# EAGLE design pH-ver1 (EAGLE 9.0.1)

## Sheet 1 of 2
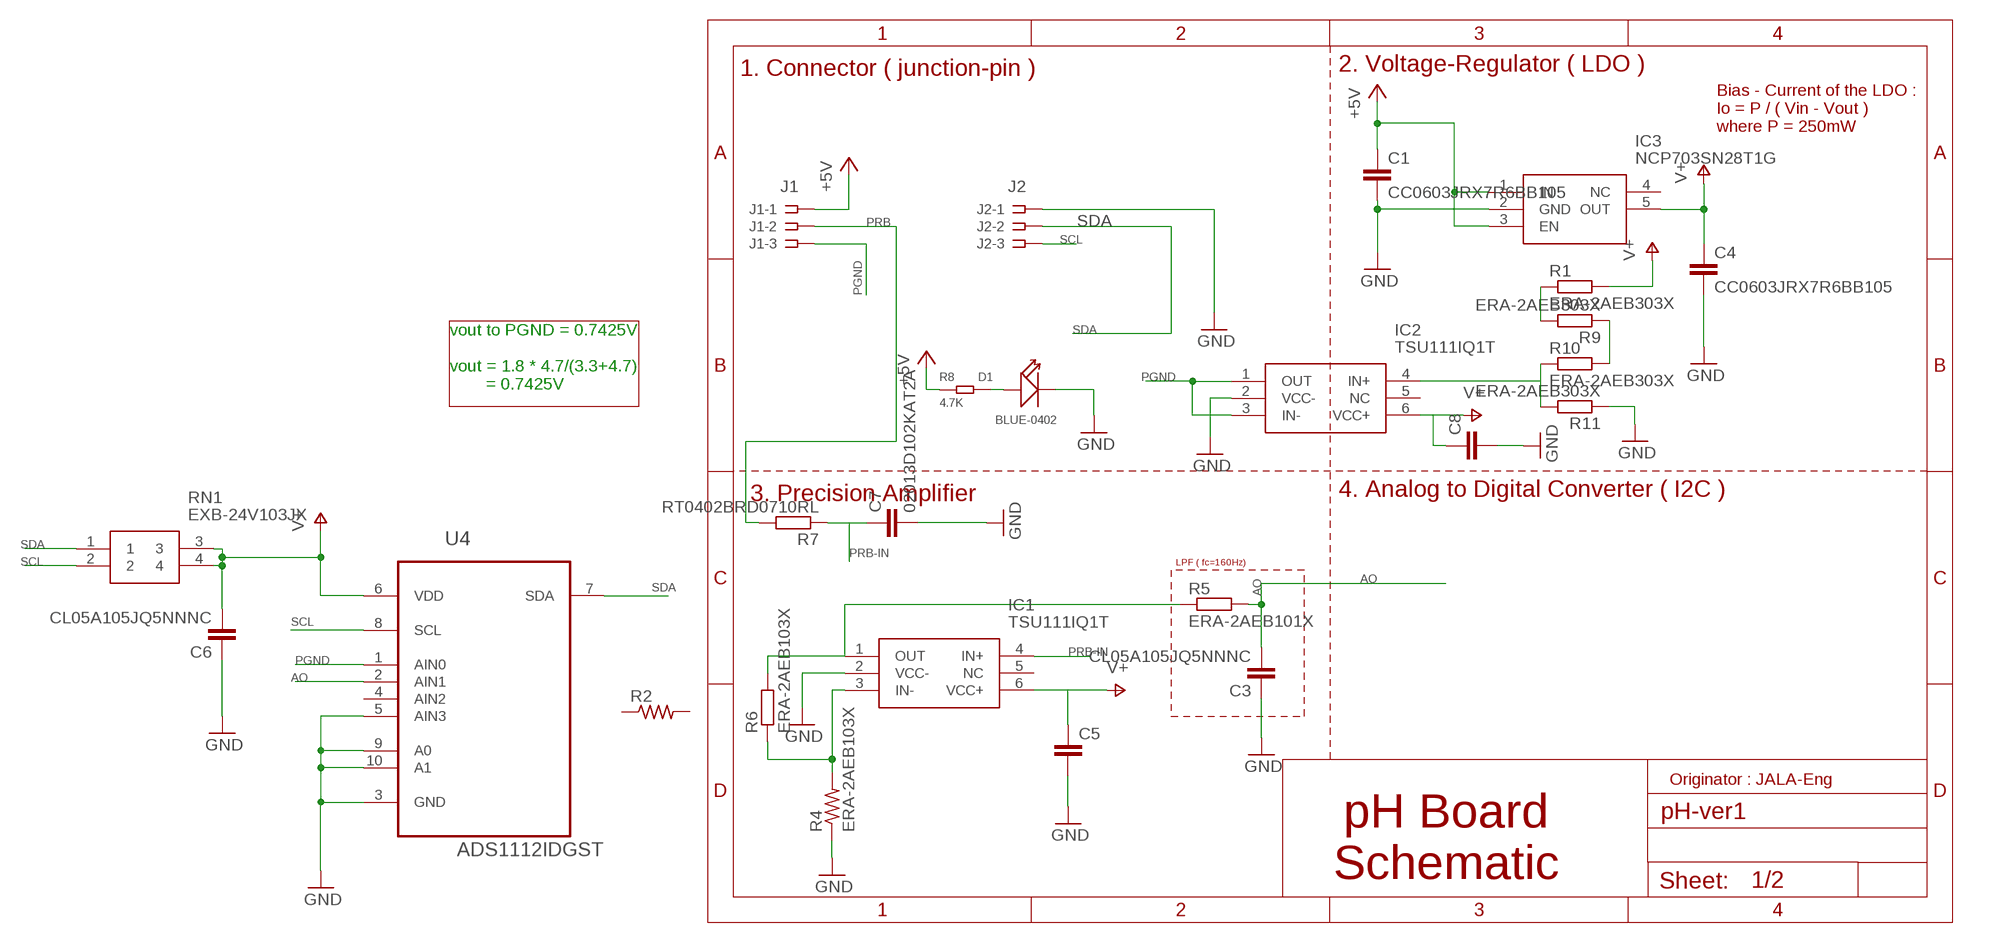
[diagram p0: schematic, sheet 1]

### Parts
C1  CC0603JRX7R6BB105  C-EUC0603  [C0603]
C3  CL05A105JQ5NNNC  C-EUC0402  [C0402]
C4  CC0603JRX7R6BB105  C-EUC0603  [C0603]
C5  C-EUC0402  [C0402]
C6  CL05A105JQ5NNNC  C-EUC0402  [C0402]
C7  02013D102KAT2A  C-EUC0402  [C0402]
C8  C-EUC0402  [C0402]
D1  BLUE-0402  SMD-LED-CLEAR-BLUE(0402)  [LED-0402]
IC1  TSU111IQ1T  [TSU111IQ1T]
IC2  TSU111IQ1T  [TSU111IQ1T]
IC3  NCP703SN28T1G  [SOT95P275X110-5N]
J1  J1  SSW-103-02-S-S  [SSW-103-02-S-S]
J2  J2  SSW-103-02-S-S  [SSW-103-02-S-S]
R1  ERA-2AEB303X  R-EU_R0402  [R0402]
R2  R-US_R0201  [R0201]
R4  ERA-2AEB103X  R-US_R0201  [R0201]
R5  ERA-2AEB101X  R-EU_R0402  [R0402]
R6  ERA-2AEB103X  R-EU_R0402  [R0402]
R7  RT0402BRD0710RL  R-EU_R0402  [R0402]
R8  4.7K  SMD-RES-4.7K-5%-1/16W(0402)  [R0402]
R9  ERA-2AEB303X  R-EU_R0402  [R0402]
R10  ERA-2AEB303X  R-EU_R0402  [R0402]
R11  ERA-2AEB303X  R-EU_R0402  [R0402]
RN1  EXB-24V103JX  [EXB24V102JX]
U4  ADS1112IDGST  [SOP50P490X110-10N]

### Nets
+5V: C1.1 IC3.1(IN) IC3.3(EN) J1.1 R8.1
AO: C3.2 R5.2 U4.2(AIN1)
GND: C1.2 C3.1 C4.2 C5.2 C6.1 C7.2 C8.2 D1.- IC1.2(VCC-) IC2.2(VCC-) IC3.2(GND) J2.1 R4.1 R11.1 U4.3(GND) U4.5(AIN3) U4.9(A0) U4.10(A1)
N$1: IC1.1(OUT) R5.1 R6.2
N$3: R1.1 R9.2
N$4: R9.1 R10.2
N$6: IC2.4(IN+) R10.1 R11.2
N$7: D1.+ R8.2
N$8: IC1.3(IN-) R4.2 R6.1
PGND: IC2.1(OUT) IC2.3(IN-) J1.3 U4.1(AIN0)
PRB: J1.2 R7.2
PRB-IN: C7.1 IC1.4(IN+) R7.1
SCL: J2.3 RN1.2 U4.8(SCL)
SDA: J2.2 RN1.1 U4.7(SDA)
V+: C4.1 C5.1 C6.2 C8.1 IC1.6(VCC+) IC2.6(VCC+) IC3.5(OUT) R1.2 RN1.3 RN1.4 U4.6(VDD)
Unconnected: IC1.5(NC) IC2.5(NC) IC3.4(NC) R2.1 R2.2 U4.4(AIN2)

### Notes on the sheet
- 1. Connector ( junction-pin ) | 2. Voltage-Regulator ( LDO )
- Bias - Current of the LDO : 
  Io = P / ( Vin - Vout )
  where P = 250mW
- vout to PGND = 0.7425V
  
  vout = 1.8 * 4.7/(3.3+4.7)
          = 0.7425V
- 3. Precision Amplifier | 4. Analog to Digital Converter ( I2C )
- LPF ( fc=160Hz)
- Originator : JALA-Eng
- pH Board
  Schematic

## Sheet 2 of 2: Documentation
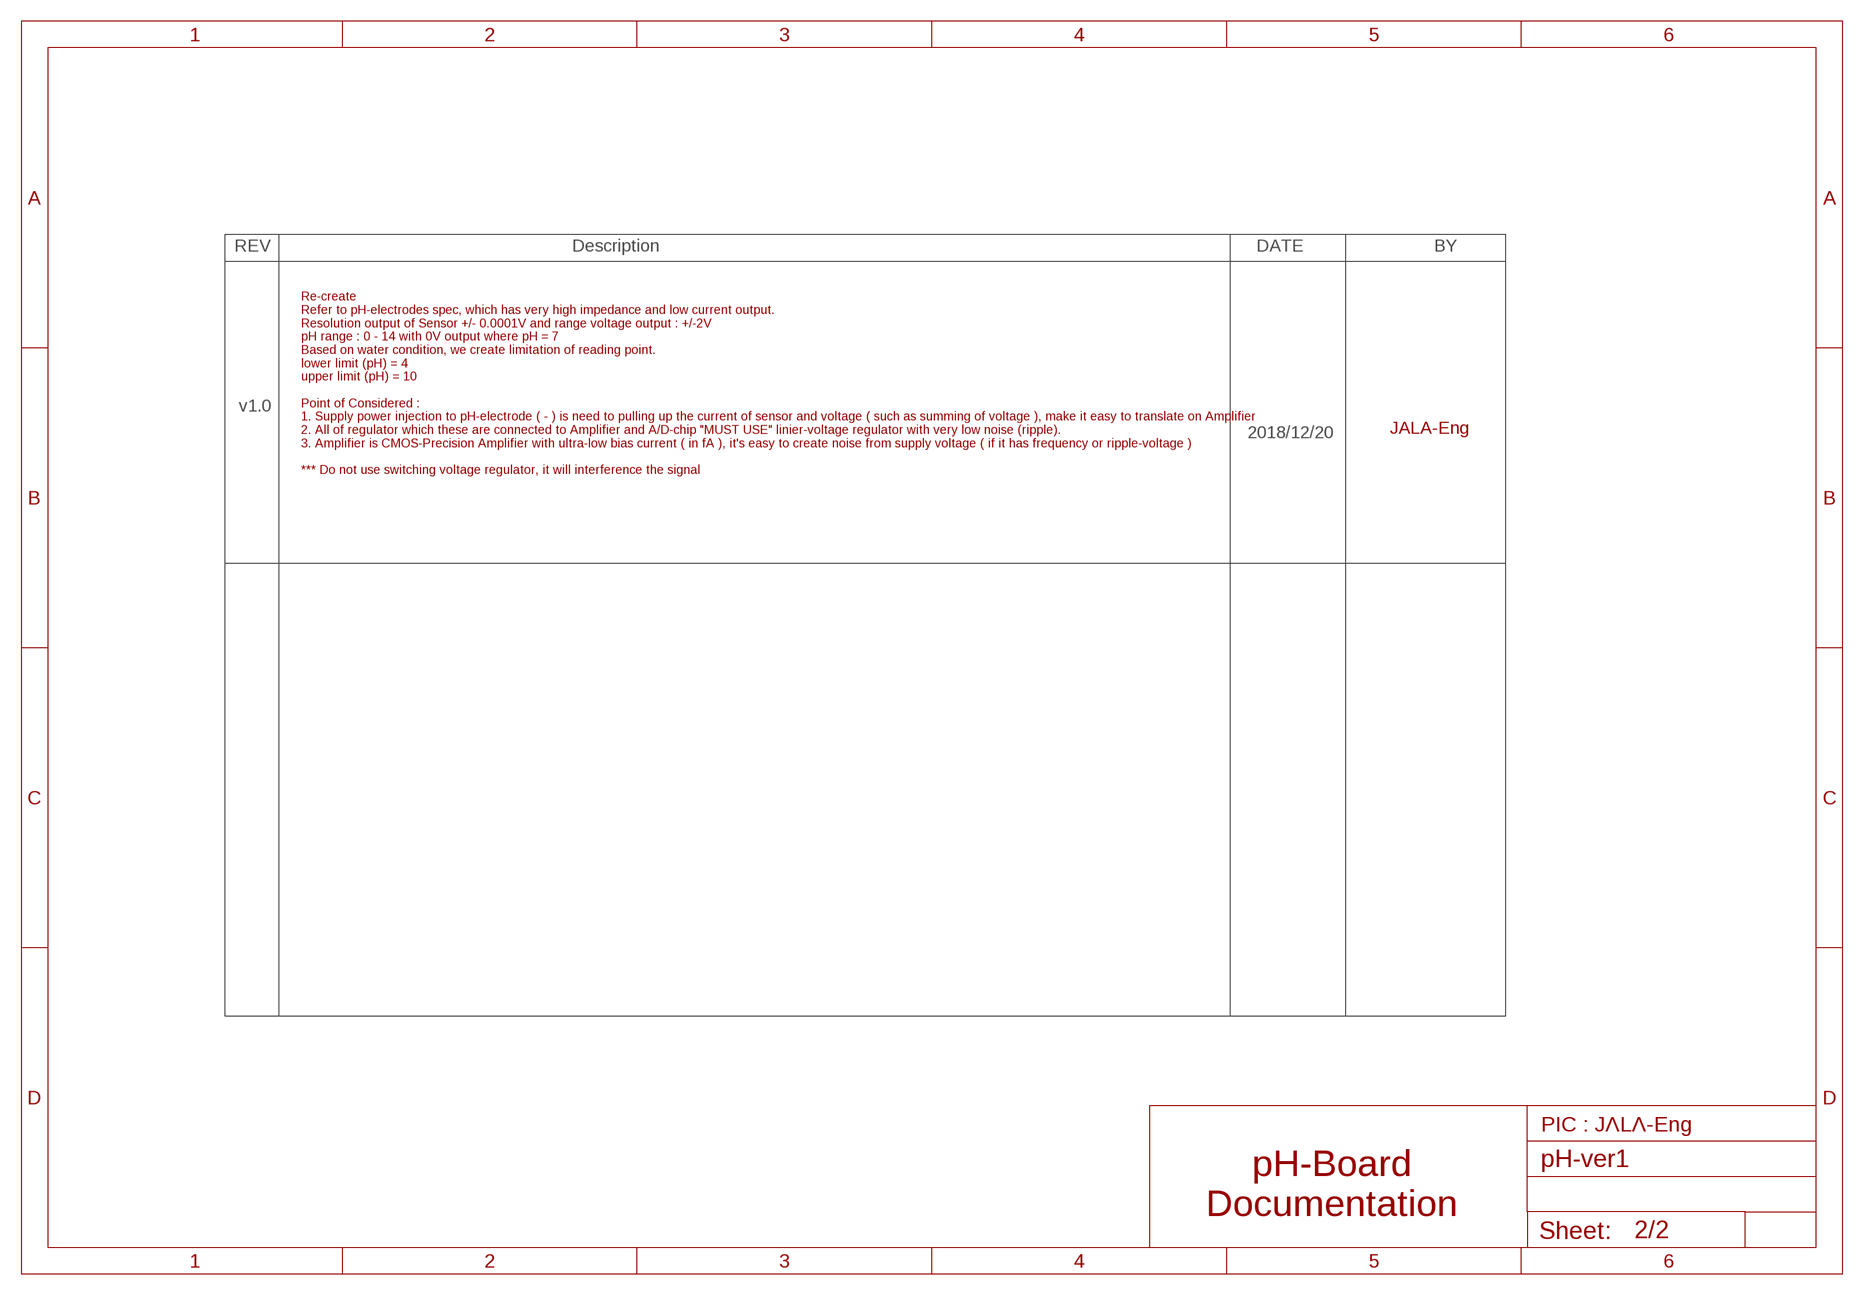
[diagram p1: schematic, sheet 2]

### Notes on the sheet
- v1.0
- 2018/12/20 | JALA-Eng
- Re-create
  Refer to pH-electrodes spec, which has very high impedance and low current output.
  Resolution output of Sensor +/- 0.0001V and range voltage output : +/-2V
  pH range : 0 - 14 with 0V output where pH = 7
  Based on water condition, we create limitation of reading point. 
  lower limit (pH) = 4
  upper limit (pH) = 10
  
  Point of Considered : 
  1. Supply power injection to pH-electrode ( - ) is need to pulling up the current of sensor and voltage ( such as summing of voltage ), make it easy to translate on Amplifier
  2. All of regulator which these are connected to Amplifier and A/D-chip "MUST USE" linier-voltage regulator with very low noise (ripple).
  3. Amplifier is CMOS-Precision Amplifier with ultra-low bias current ( in fA ), it's easy to create noise from supply voltage ( if it has frequency or ripple-voltage )
  
  *** Do not use switching voltage regulator, it will interference the signal
- PIC : JΛLΛ-Eng
- pH-Board
  Documentation

## Library data of the parts
C1 C3-C8 = resistor:C-EU: CAPACITOR, European symbol
D1 = Seeed-LED:SMD-LED-CLEAR-BLUE(0402): 304090075; MPN: BL-HB337A-AV-TRB
IC1 IC2 = TSU111IQ1T:TSU111IQ1T: STMicroelectronics TSU111IQ1T, Low Power, Op Amp, RRIO, 11.5kHz, 5 V, 6-Pin DFN Source: Datasheet <https://www.st.com/resource/en/datasheet/tsu111.pdf>; DESCRIPTION: STMicroelectronics TSU111IQ1T, Low Power, Op Amp, RRIO, 11.5kHz, 5 V, 6-Pin DFN; HEIGHT: 1mm; MANUFACTURER_NAME: STMicroelectronics; MANUFACTURER_PART_NUMBER: TSU111IQ1T; MOUSER_PART_NUMBER: 511-TSU111IQ1T; MOUSER_PRICE-STOCK: https://www.mouser.com/Search/Refine.aspx?Keyword=511-TSU111IQ1T; RS_PART_NUMBER: 1623657; RS_PRICE-STOCK: http://uk.rs-online.com/web/p/products/1623657
IC3 = NCP703SN28T1G:NCP703SN28T1G: Source: Datasheet <http://www.onsemi.com/pub/Collateral/NCP703-D.PDF>; ALLIED_NUMBER: 70400699; ALLIED_PRICE-STOCK: http://www.alliedelec.com/on-semiconductor-ncp703sn28t1g/70400699/; HEIGHT: 1.1mm; MANUFACTURER_NAME: ON Semiconductor; MANUFACTURER_PART_NUMBER: NCP703SN28T1G; MOUSER_PART_NUMBER: 863-NCP703SN28T1G; MOUSER_PRICE-STOCK: https://www.mouser.com/Search/Refine.aspx?Keyword=863-NCP703SN28T1G; RS_PART_NUMBER: 8270566P; RS_PRICE-STOCK: http://uk.rs-online.com/web/p/products/8270566P
J1 J2 = con-samtec:SSW-103-02-S-S: THROUGH-HOLE .025" SQ POST SOCKET Source: Samtec SSW.pdf; MPN: SSW-103-02-S-S; OC_FARNELL: unknown; OC_NEWARK: 11P9367
R1 R5-R7 R9-R11 = resistor:R-EU_: RESISTOR, European symbol
R2 R4 = resistor:R-US_: RESISTOR, American symbol
R8 = Seeed-Resistor:SMD-RES-4.7K-5%-1/16W(0402): 301010010; MPN: RC0402JR-074K7L
RN1 = EXB-24V103JX:EXB-24V103JX: Resistor Networks & Arrays Resistor Array Chip 0404 2 elements Source: Datasheet <https://industrial.panasonic.com/cdbs/www-data/pdf/AOC0000/AOC0000C14.pdf>; DESCRIPTION: Resistor Networks & Arrays Resistor Array Chip 0404 2 elements; HEIGHT: 0.45mm; MANUFACTURER_NAME: Panasonic; MANUFACTURER_PART_NUMBER: EXB-24V103JX; MOUSER_PART_NUMBER: 667-EXB-24V103JX; MOUSER_PRICE-STOCK: https://www.mouser.com/Search/Refine.aspx?Keyword=667-EXB-24V103JX
U4 = ADS1112IDGST:ADS1112IDGST: 16-Bit Analog-to-Digital Converter with Input Multiplexer and Onboard Reference; AVAILABILITY: Unavailable; DESCRIPTION: 16-bit 240SPS ADC, 2 Ch. Diff/3 Single-end input, Low power Complete System in MSOP-10 10-VSSOP -40 to 85; MF: Texas Instruments; MP: ADS1112IDGST; PACKAGE: MSOP-10 Texas Instruments; PRICE: None

## Board
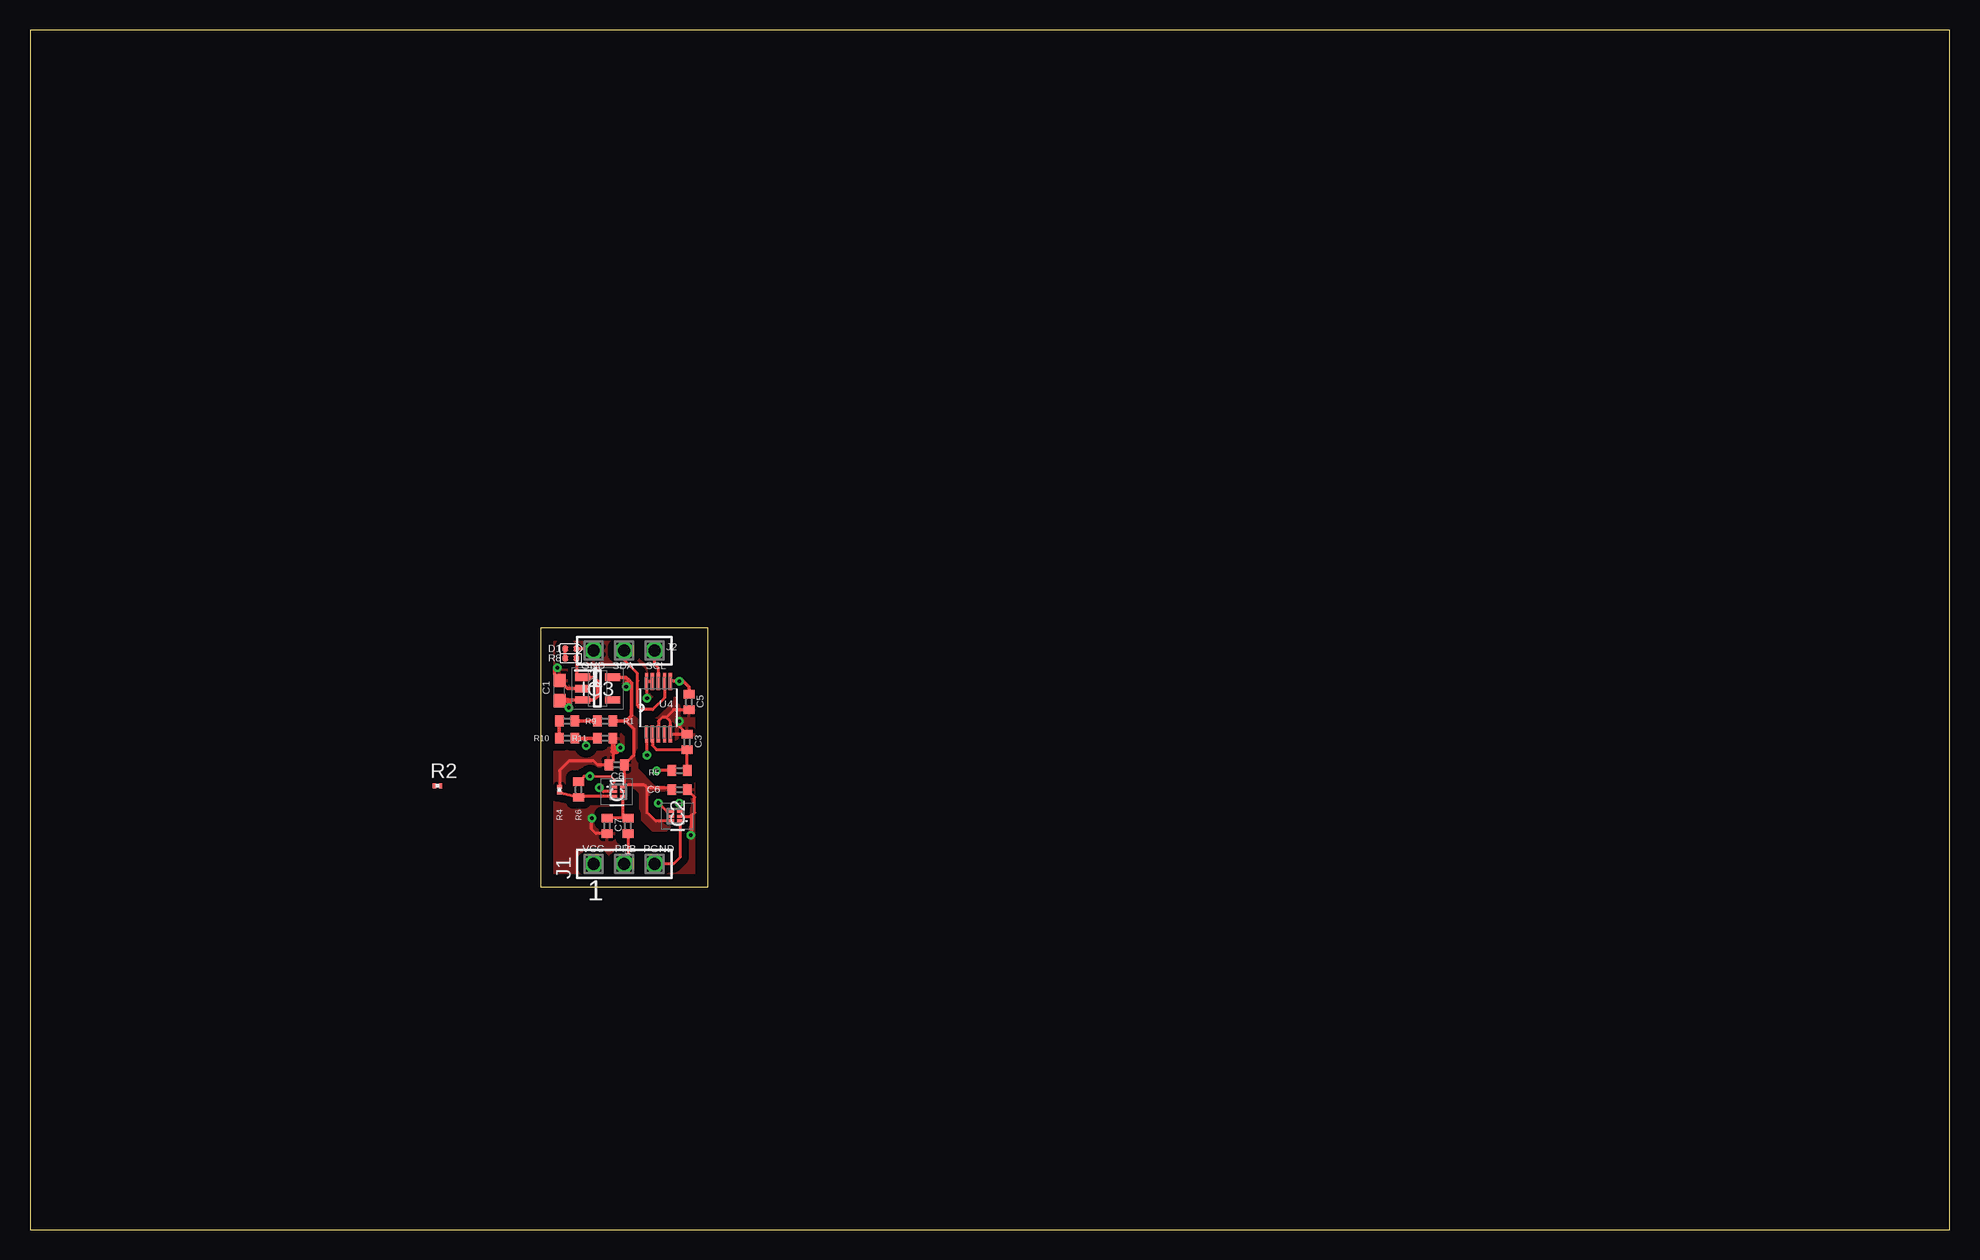
[diagram p2: board, top side]
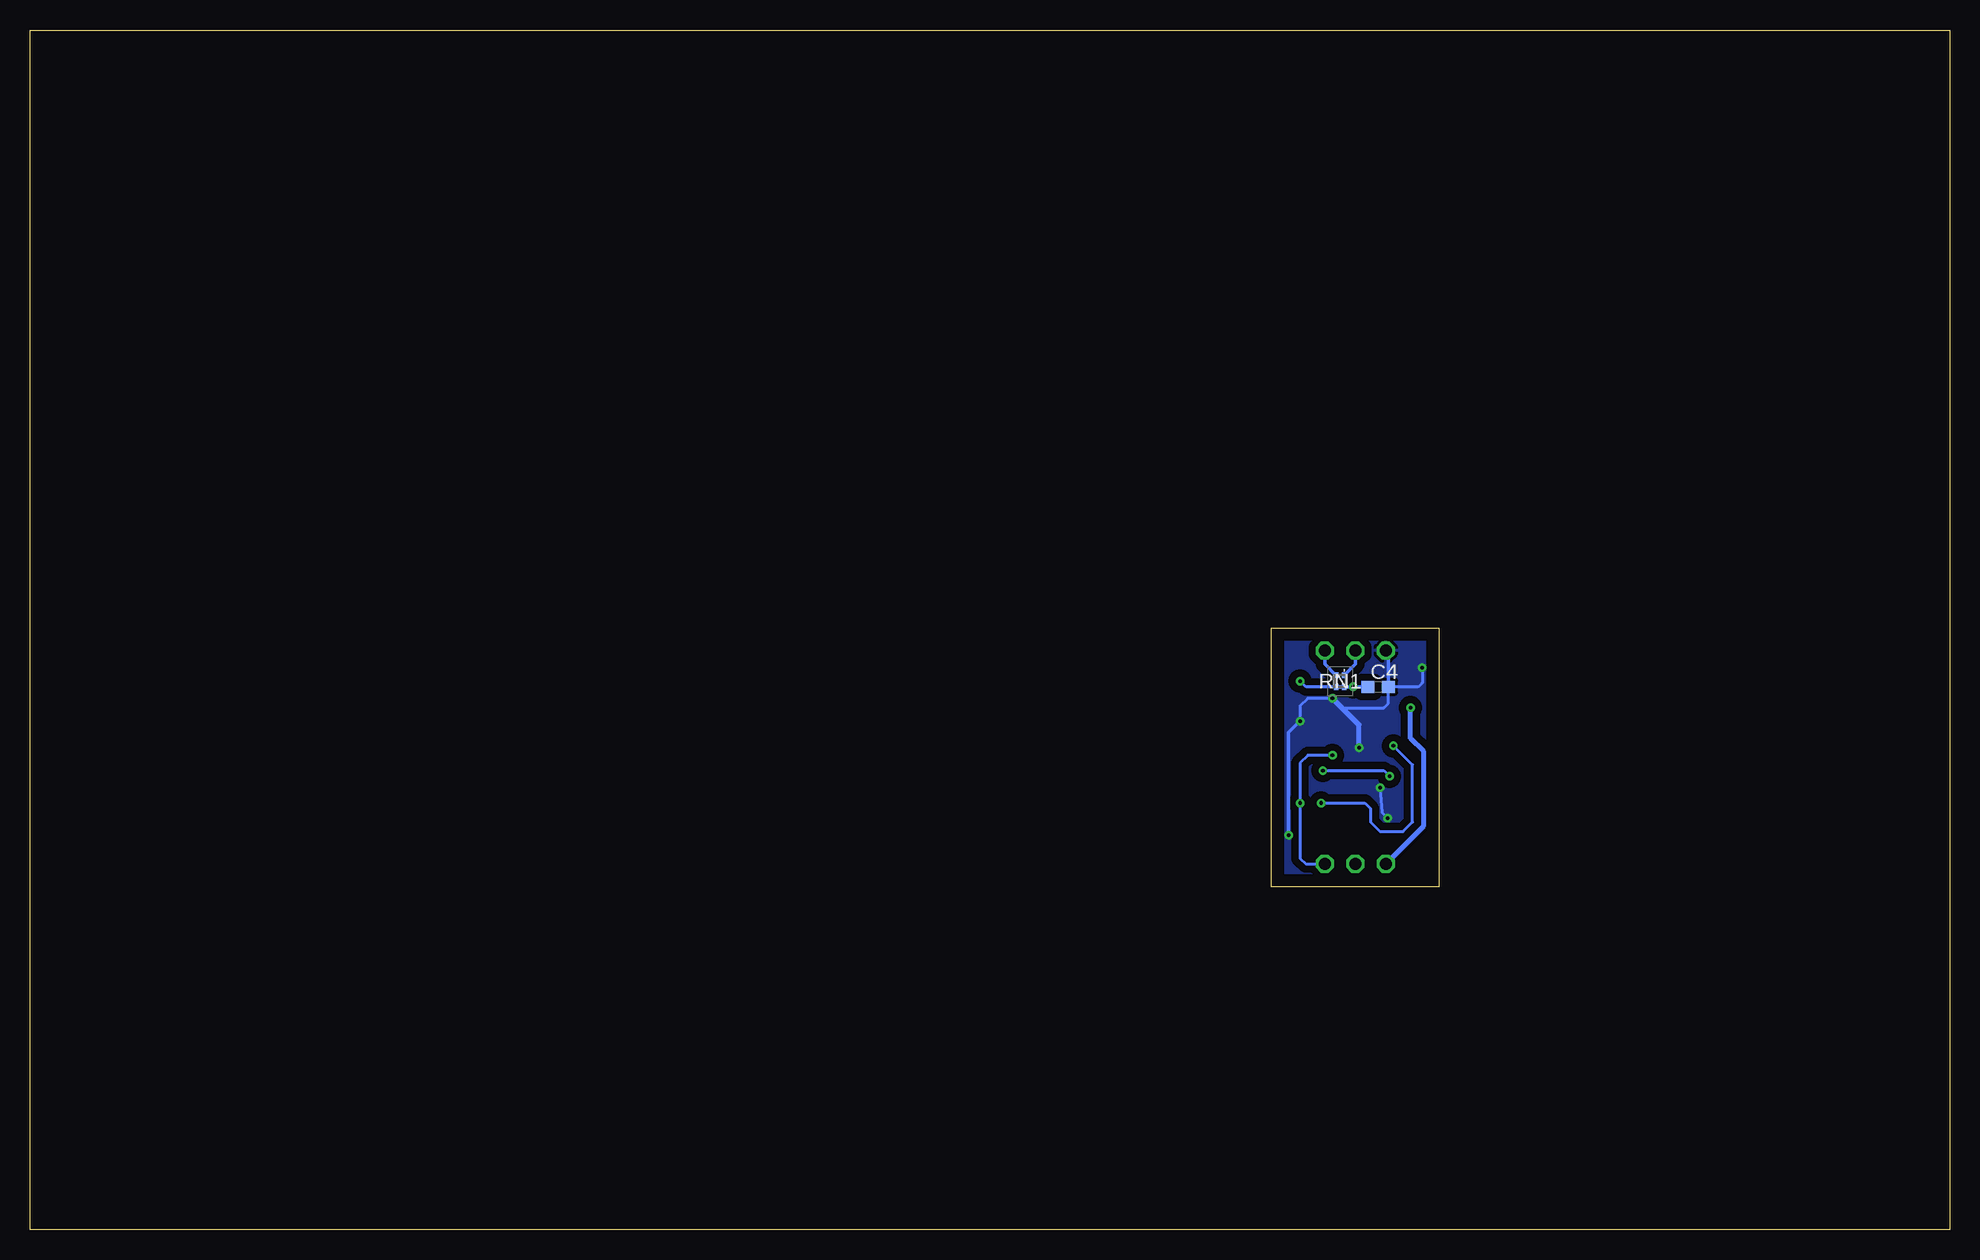
[diagram p3: board, bottom side, seen from below]

Size 160 x 100 mm. Coordinates in mm from the lower left corner, seen from the top.
Outline: 0,0 160,0 160,100 0,100 0,0
Outline: 42.55,28.57 56.52,28.57 56.52,50.16 42.55,50.16 42.55,28.57
Copper layers (1*16): Top 0.035mm / dielectric 1.5mm / Bottom 0.035mm
Design rules "default": minimum track width 10mil, minimum drill 24mil, track to track 8mil, track to pad 8mil, pad to pad 8mil, via to via 8mil, smd to smd 8mil, copper to edge 40mil, drill to drill 8mil, minimum pad ring 10mil, minimum via ring 8mil, stop-mask expansion 4mil, vias tented up to drill 0mil, thermal gap 10mil

### Footprints (pad centres in the part's own frame; a part is rotated, then mirrored left to right if it is on the bottom)
C0603 = smd 1.1 x 1: 1 -0.85,0; 2 0.85,0
C0402 = smd 0.7 x 0.9: 1 -0.65,0; 2 0.65,0
LED-0402 = smd 0.5 x 0.5: + -0.463,0; - 0.463,0
TSU111IQ1T = smd 0.25 x 0.475: 1 0.4,0.362; 2 0,0.362; 3 -0.4,0.362; 4 -0.4,-0.362; 5 0,-0.362; 6 0.4,-0.362
SOT95P275X110-5N = smd 1.25 x 0.6: 1 -1.25,0.95; 2 -1.25,0; 3 -1.25,-0.95; 4 1.25,-0.95; 5 1.25,0.95
SSW-103-02-S-S = drill 1 pad 1.5 octagon: 1 -2.54,0; 2 0,0; 3 2.54,0
R0402 = smd 0.7 x 0.9: 1 -0.65,0; 2 0.65,0
R0201 = smd 0.28 x 0.43: 1 -0.255,0; 2 0.255,0
R0402' = smd 0.5 x 0.5: 1 0,0.463; 2 0,-0.463
EXB24V102JX = smd 0.375 x 0.475: 1 -0.337,-0.487; 2 0.337,-0.487; 3 0.337,0.488; 4 -0.337,0.488
SOP50P490X110-10N = smd 1.422 x 0.279: 1 -2.184,0.991; 2 -2.184,0.508; 3 -2.184,0; 4 -2.184,-0.508; 5 -2.184,-0.991; 6 2.184,-0.991; 7 2.184,-0.508; 8 2.184,0; 9 2.184,0.508; 10 2.184,0.991

### Placement (x,y rotation side)
C1  44.13,44.93 90 top
C3  54.77,40.64 270 top
C4  47.62,45.24 0 bottom
C5  54.93,43.97 270 top
C6  54.13,36.67 180 top
C7  48.1,33.66 270 top
C8  48.9,38.73 180 top
D1  45.09,48.42 0 top
IC1  49.05,36.51 90 top
IC2  53.82,34.45 270 top
IC3  47.31,45.09 0 top
J1  49.53,30.48 0 top
J2  49.53,48.26 0 top
R1  47.94,42.39 0 top
R2  33.97,36.99 0 top
R4  44.13,36.67 270 top
R5  54.13,38.26 0 top
R6  45.72,36.67 90 top
R7  49.85,33.66 270 top
R8  4.7K  [R0402']  45.09,47.62 270 top
R9  44.77,42.39 0 top
R10  44.77,40.96 180 top
R11  47.94,40.96 180 top
RN1  50.8,45.72 180 bottom
U4  52.39,43.5 90 top

### Tracks (layer width: path | path; a pad name or v marks a point on that pad's centre or on a via)
+5V  (via drill 0.3)
  Top 0.254: R8.1 45.55,46.21 45.72,46.03 IC3.1
  Top 0.305: C1.1 44.19,44.13 44.77,44.13 IC3.3 46.99,44.13 47.31,44.45 47.31,45.72 46.99,46.03 IC3.1
  Top 0.406: v44.93,43.5 44.93,43.98 44.77,44.13
  Bottom 0.406: J1.1 43.81,33.66 43.81,39.85 44.93,40.96 v44.93,43.5 44.93,43.66
AO
  Top 0.254: U4.2 51.88,40.35 52.23,40.01 54.62,40.01 54.7,40.08 | 54.7,40.08 C3.2 | R5.2 54.78,39.99 54.7,40.08
GND  (via drill 0.3)
  Top 0.24: IC1.2 47.78,36.51
  Top 0.254: C1.2 44.13,45.88 43.73,46.28 43.73,46.67 43.95,46.76 v43.95,46.83 | D1.- 46.83,48.42 J2.1 | 53.02,42.7 53.38,42.35 U4.5 53.4,41.29 C3.1 54.13,41.92 v54.13,42.39 | 53.02,42.7 52.7,42.7 52.39,42.39 U4.3 | C5.2 53.64,43.32 53.02,42.7 | U4.10 51.4,44.17 v51.44,44.29 | R4.1 44.13,38.26 44.93,39.05 46.99,39.05 47.31,38.73 C8.2 48.59,39.08 48.59,39.85 | 47.78,36.51 v47.47,36.83 | C7.2 48.09,33.02 47.15,33.02 46.83,33.34 v46.83,34.29 | IC2.2 55.09,34.45 55.17,34.53 55.4,34.77 55.4,36.05 C6.1
  Top 0.305: C1.2 44.82,45.09 IC3.2 | U4.10 U4.9 | 55.17,34.53 55.17,32.94 55.24,32.86 v55.09,32.86
  Top 0.406: R11.1 48.59,39.85 48.9,39.85 v49.21,40.16
  Bottom 0.254: v43.95,46.83 43.95,45.58 44.29,45.24 C4.2 46.77,43.87 47.15,43.5 50.64,43.5 v51.44,44.29 53.5,44.29 54.13,43.66 v54.13,42.39 | v47.47,36.83 47.31,34.77 v46.83,34.29
  Bottom 0.305: C4.2 46.77,48.05 J2.1 | v55.09,32.86 55.09,41.43 v54.13,42.39
  Bottom 0.406: v49.21,40.16 49.21,42.07 v51.44,44.29
  pour Bottom (isolate 0.61, rank 6): 56.36,28.73 42.86,28.73 42.86,50.01 56.36,50.01
  pour Top (isolate 0.61, rank 6): 42.7,50.01 56.36,50.01 56.36,28.73 42.7,28.73
N$1  (via drill 0.3)
  Top 0.203: IC1.1 48.69,37.51 48.42,37.78 v46.67,37.78
  Top 0.254: R5.1 v52.23,38.26 | v46.67,37.78 46.18,37.78 R6.2
  Bottom 0.254: v52.23,38.26 47.15,38.26 v46.67,37.78
N$3
  Top 0.305: R9.2 R1.1
N$4
  Top 0.305: R10.2 R9.1
N$6  (via drill 0.3)
  Top 0.254: IC2.4 53.1,34.85 v52.39,35.56 | v46.35,40.32 46.35,40.96
  Top 0.305: R11.2 46.35,40.96 R10.1
  Bottom 0.254: v52.39,35.56 48.74,35.56 48.26,35.08 48.26,33.97 47.47,33.18 45.56,33.18 44.77,33.97 44.77,38.73 v46.35,40.32
N$7
  Top 0.254: R8.2 D1.+
N$8
  Top 0.254: IC1.3 45.81,36.11 R6.1 R4.2
PGND  (via drill 0.3)
  Top 0.254: IC2.3 54.18,35.52 v54.13,35.56 | IC2.1 54.18,31 53.66,30.48 J1.3 | U4.1 51.4,39.41 v51.44,39.53
  Bottom 0.254: J1.3 53.66,30.48 54.13,30.96 v54.13,35.56 54.13,38.89 53.5,39.53 v51.44,39.53
PRB
  Top 0.254: R7.2 49.85,30.8 J1.2
PRB-IN
  Top 0.254: R7.1 49.53,34.3 | 49.53,34.3 C7.1 | IC1.4 49.42,34.42 49.53,34.3
SCL
  Top 0.254: U4.8 52.39,46.83 52.07,47.15 J2.3
  Bottom 0.305: RN1.2 52.07,47.14 J2.3
SDA
  Top 0.254: U4.7 52.9,44.32 51.91,43.34 50.96,43.34 50.65,43.65 50.65,45.76 50.64,45.77 50.64,46.35 49.53,47.47 J2.2
  Bottom 0.305: RN1.1 49.53,47.14 J2.2
V+  (via drill 0.3)
  Top 0.254: 53.66,45.72 53.42,45.72 U4.6 | IC1.6 49.55,37.04 | 49.55,37.04 C8.1 50.32,39.51 50.32,41.75 49.69,42.39 | IC2.6 52.15,34.05 51.44,34.77 51.44,36.83 | 51.44,36.83 51.22,37.04 49.55,37.04 | C6.2 53.33,36.83 51.44,36.83
  Top 0.305: R1.2 49.69,42.39 50.16,42.86 50.16,45.56 49.93,45.8 | 49.93,45.8 49.69,46.04 49.69,46.03 IC3.5 | v49.69,45.24 49.69,45.56 49.93,45.8 | C5.1 54.93,45.24 54.45,45.72 v54.13,45.72 53.66,45.72
  Bottom 0.254: RN1.3 53.65,45.23 v54.13,45.72
  Bottom 0.305: RN1.3 RN1.4 v49.7,45.23 v49.69,45.24 C4.1
  pour Top (isolate 0.61): 48.58,46.04 49.69,46.04 50.16,45.56 50.16,43.02 50.64,42.55 50.64,38.42 51.91,37.15 52.07,36.99 53.5,36.99 53.5,36.51 51.91,36.51 51.44,36.04 51.44,34.77 52.07,34.13 52.23,33.97 53.5,33.97 53.5,33.66 53.02,33.18 51.91,33.18 50.8,34.29 50.8,36.35 50.16,36.99 49.69,36.99 49.53,37.15 49.53,38.89 50.32,39.69 50.32,41.59 49.69,42.23 49.69,42.39 50.01,42.7 50.01,44.93 49.69,45.24 49.05,45.88 48.58,45.88

### Text on the board
tPlace: Please print lettering / Symbol & text ( code ) / using layer tPlace & bPlace only
bOrigins: pH
tNames: GND | SDA | SCL | VCC | PRB | PGND
SST: NC | GND | VO | PRB | GND | +5V